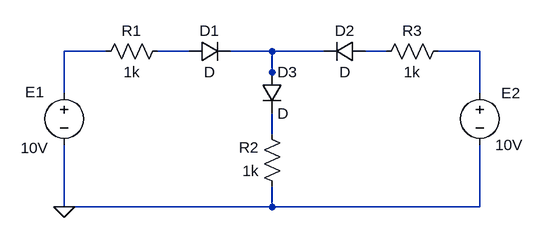
[diagram p0: schematic Draft1.asc]
Draft1.asc, the LTspice schematic file:
Version 4
SHEET 1 880 680
WIRE 16 64 -48 64
WIRE 144 64 96 64
WIRE 272 64 208 64
WIRE 352 64 272 64
WIRE 448 64 416 64
WIRE 592 64 528 64
WIRE 272 96 272 64
WIRE 272 112 272 96
WIRE -48 128 -48 64
WIRE 592 128 592 64
WIRE 272 192 272 160
WIRE -48 304 -48 208
WIRE 272 304 272 272
WIRE 272 304 -48 304
WIRE 592 304 592 208
WIRE 592 304 272 304
FLAG -48 304 0
SYMBOL voltage -48 112 R0
WINDOW 0 -60 15 Left 2
WINDOW 3 -67 101 Left 2
SYMATTR InstName E1
SYMATTR Value 10V
SYMBOL voltage 592 112 R0
WINDOW 0 33 16 Left 2
SYMATTR InstName E2
SYMATTR Value 10V
SYMBOL res 112 48 R90
WINDOW 0 0 56 VBottom 2
WINDOW 3 32 56 VTop 2
SYMATTR InstName R1
SYMATTR Value 1k
SYMBOL res 288 288 R180
WINDOW 0 36 76 Left 2
WINDOW 3 36 40 Left 2
SYMATTR InstName R2
SYMATTR Value 1k
SYMBOL res 432 80 R270
WINDOW 0 32 56 VTop 2
WINDOW 3 0 56 VBottom 2
SYMATTR InstName R3
SYMATTR Value 1k
SYMBOL diode 416 48 R90
WINDOW 0 0 32 VBottom 2
WINDOW 3 32 32 VTop 2
SYMATTR InstName D2
SYMBOL diode 256 96 R0
SYMATTR InstName D3
SYMBOL diode 144 80 R270
WINDOW 0 32 32 VTop 2
WINDOW 3 0 32 VBottom 2
SYMATTR InstName D1

The netlist it stands for:
* Draft1.asc
V§E1 N001 0 10V
V§E2 N005 0 10V
R1 N002 N001 1k
R2 0 N006 1k
R3 N004 N005 1k
D2 N004 N003 D
D3 N003 N006 D
D1 N002 N003 D
.model D D
.lib standard.dio
.backanno
.end